# EAGLE schematic Magnetventil Ansteuerung (EAGLE 7.3.0)
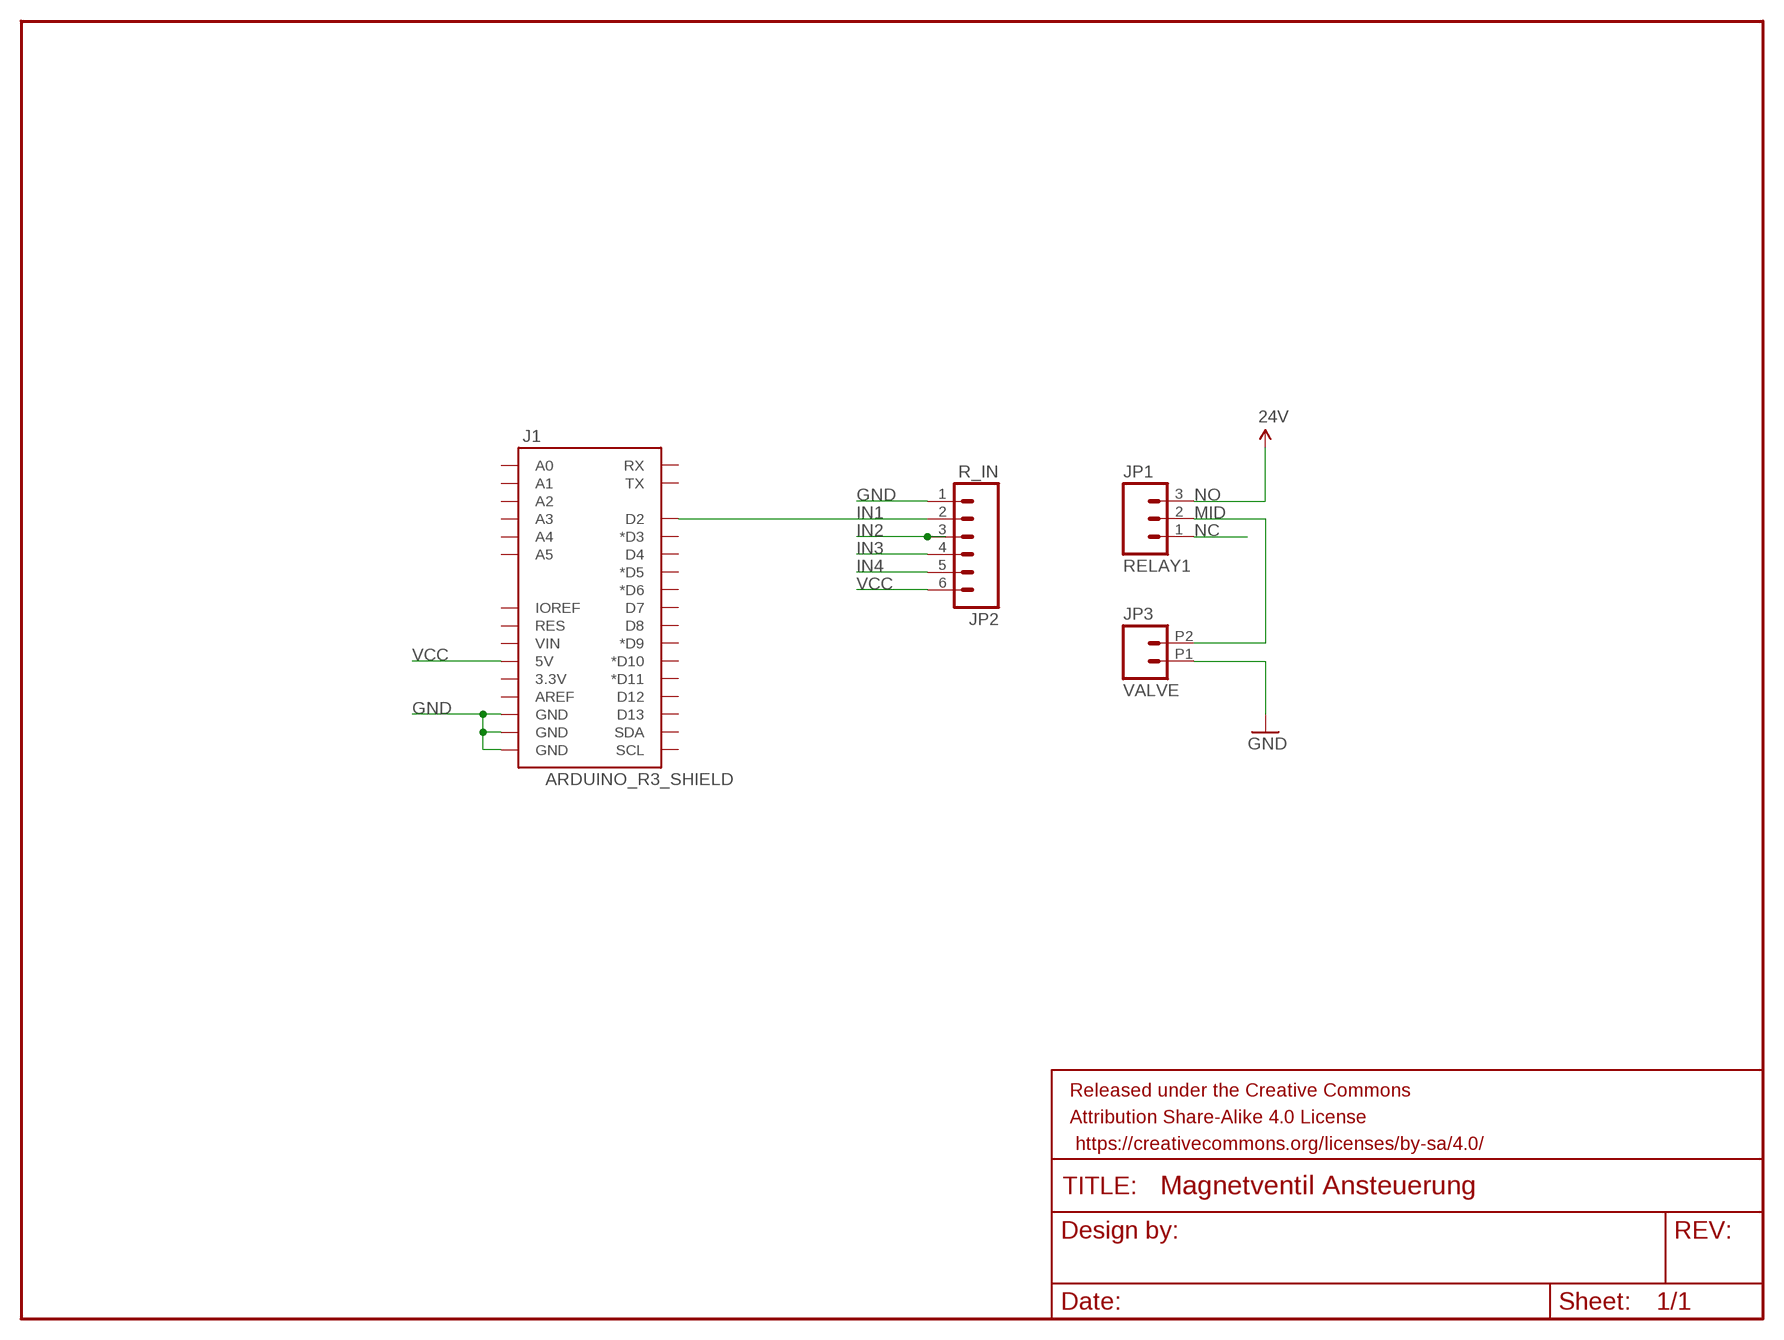
[diagram p0: schematic, sheet 1]

## Parts
FRAME1  FRAME-LETTER  [CREATIVE_COMMONS]
J1  ARDUINO_R3_SHIELD  [UNO_R3_SHIELD]
JP1  RELAY1  M03-SCREW-5MM  [SCREWTERMINAL-5MM-3]
JP2  R_IN  M06LOCK  [1X06_LOCK]
JP3  VALVE  M022.54MM_SCREWTERM  [1X02_2.54_SCREWTERM]

## Nets
GND: J1.GND@0(GND) J1.GND@1(GND) J1.GND@2(GND) JP2.1 JP3.P1
IN1: J1.D2 JP2.2
IN2: JP2.3
IN3: JP2.4
IN4: JP2.5
MID: JP1.2 JP3.P2
NC: JP1.1
NO: JP1.3 ; supply symbol labelled 24V
VCC: J1.5V JP2.6
Unconnected: J1.3.3V J1.A0 J1.A1 J1.A2 J1.A3 J1.A4 J1.A5 J1.AREF J1.D3(*D3) J1.D4 J1.D5(*D5) J1.D6(*D6) J1.D7 J1.D8 J1.D9(*D9) J1.D10(*D10) J1.D11(*D11) J1.D12 J1.D13 J1.IOREF J1.RES J1.RX J1.SCL J1.SDA J1.TX J1.VIN

## Library data of the parts
FRAME1 = SparkFun-Aesthetics:FRAME-LETTER: Schematic Frame Standard 8.5x11 US Letter frame; DESIGNER: NAME; VERSION: v01
J1 = SparkFun-Boards:ARDUINO_R3_SHIELD: Shield form compatible with the Arduino Uno R3.
JP1 = SparkFun-Connectors:M03: Header 3 Standard 3-pin 0.1" header. Use with straight break away headers (SKU : PRT-00116), right angle break away headers (PRT-00553), swiss pins (PRT-00743), machine pins (PRT-00117), and female headers (PRT-00115). Molex polarized connector foot print use with SKU : PRT-08232 with associated crimp pins and housings.; STOREFRONT_ID: PRT-08433
JP2 = SparkFun-Connectors:M06: Header 6 Standard 6-pin 0.1" header. Use with straight break away headers (SKU : PRT-00116), right angle break away headers (PRT-00553), swiss pins (PRT-00743), machine pins (PRT-00117), and female headers (PRT-00115). Molex polarized connector foot print use with SKU : PRT-08094 with associated crimp pins and housings. NOTES ON THE VARIANTS LOCK and LOCK_LONGPADS... This footprint was designed to help hold the alignment of a through-hole component (i.e. 6-pin header) while soldering it into place. You may notice that each hole has been shifted either up or down by 0.005 of an inch from it's more standard position (which is a perfectly straight line). This slight alteration caused the pins (the squares in the middle) to touch the edges of the holes. Because they are alternating, it causes a "brace" to hold the component in place. 0.005 has proven to be the perfect amount of "off-center" position when using our standard breakaway headers. Although looks a little odd when you look at the bare footprint, once you have a header in there, the alteration is very hard to notice. Also,if you push a header all the way into place, it is covered up entirely on the bottom side. This idea of altering the position of holes to aid alignment will be further integrated into the Sparkfun Library for other footprints. It can help hold any component with 3 or more connection pins.
JP3 = SparkFun-Connectors:M02: Standard 2-pin 0.1" header. Use with - straight break away headers ( PRT-00116) - right angle break away headers (PRT-00553) - swiss pins (PRT-00743) - machine pins (PRT-00117) - female headers (PRT-00115) Molex polarized connector foot print use with: PRT-08233 with associated crimp pins and housings. 2.54_SCREWTERM for use with PRT-10571. 3.5mm Screw Terminal footprints for PRT-08084 5mm Screw Terminal footprints for use with PRT-08432